# Altium schematic sheet 02_Power1.SchDoc
size A4; DocumentNumber: 2; SheetNumber: 2; SheetTotal: 7
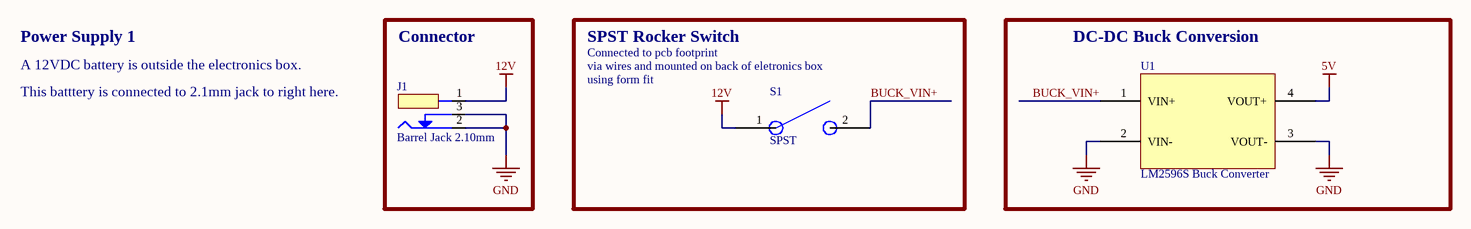
[diagram p0: 02_Power1.SchDoc]

## Parts
J1  Barrel Jack 2.10mm  [2.1mm Barrel Jack Connector]
S1  SPST  [SPST Switch]
U1  LM2596S Buck Converter  [LM2596S Buck Converter]

## Blocks framed on the sheet
Connector: J1
SPST Rocker Switch: S1
DC-DC Buck Conversion: U1

## Nets
5V: U1.4(VOUT+)
12V: J1.1 S1.1(+)
GND: J1.2 J1.3 U1.2(VIN-) U1.3(VOUT-)
BUCK_VIN+: S1.2(-) U1.1(VIN+)

## Notes on the sheet
- Power Supply 1
- (near J1) This batttery is connected to 2.1mm jack to right here.
- A 12VDC battery is outside the electronics box.
- Connected to pcb footprint
- via wires and mounted on back of eletronics box
- using form fit
- Title:
- Company:
- Date:
- Sheet
- of
- Drawn By:

## Library data of the parts
J1 = 54-00133: Power Barrel Connector Jack 2.10mm ID (0.083"), 5.50mm OD (0.217") Through Hole, Right Angle; Manufacturer: Tensility; Body Material: Copper Alloy; Gender: Male; Shielding: Unshielded; Voltage Rating: 48V; Current Rating: 6A; Supplier 1: Digi-Key; Manufacturer Part Number: 54-00133; RoHS: No; Category: Connectors; Stock 1: 8232; Pricing 1: 1=1.05000, 10=0.89100, 25=0.85440, 50=0.83620, 100=0.79990, 250=0.72720, 500=0.65448, 1000=0.58176, 2500=0.52722 (USD); Mounting Technology: Through Hole; Contact Plating: Silver; Contact Material: Bronze,Brass; Insulation Color: Black; Housing Material: PBT; Min Operating Temperature: -25°C; Max Operating Temperature: 85°C; Connector Type: Jack; Packaging: Bulk; Termination: Solder; ComponentLink1URL: http://www.tensility.com/pdffiles/54-00133.pdf?src-supplier=Digi-Key; ComponentLink1Description: http://www.tensility.com/pdffiles/54-00133.pdf?src-supplier=Digi-Key; Supplier Part Number 1: 839-1516-ND
S1 = SPST Switch
U1 = LM2596S Buck Converter: Product parameters: input voltage is 4.0V - 40V, output voltage is 1.25V - 37V, output current is 2A (normal and stable) and 3A max, conversion efficiency 92% (highest), output ripple under 30mV, switching frequency 150KHz, operating temperature is -45 to 85 degree Celsius / Simple to operate: the voltmeter can be turned off, and the switch can be turned off by pressing and holding the switch for more than 1 second and less than 4 seconds, once the voltmeter is turned off, simply press the switch to turn on the voltmeter / Easy to use: with terminal block, no soldering iron is also convenient to use, and retain the wire bond point (the input voltage must be higher than the voltage to be output by 1v or more) / Output current: the maximum output current can be as high as 3A, the recommended working current is about 2A, more than 2A plus heat sink / Nice design: with 150KHz internal oscillation frequency, features low power consumption and high efficiency; When the output voltage cannot be adjusted and is always equal to the input voltage, please turn the potentiometer counterclockwise for more than 10 turns, and then use the module to adjust the voltage normally; This is because when the module leaves the factory, the default output voltage is about 20V; Manufacturer: Frienda; Manufacturer Part Number: Frienda-Power Converters-01; Input Voltage: 4.0-40.0V; Output Voltage: 1.25-37.0V; Supplier: Amazon; RoHS: Unavailable; Category: DC-DC Buck Conversion; Stock: 4; Pricing: 13.99; Output Current: 2A; Max Output Current: 3A; Frequency: 150kHz; Length: 7.05in; Width: 4.72in; Height: 0.83in; Operating Temperature: -40-+85 deg C; Supplier Part Number: B081N6WWJS